# EAGLE schematic Cooler-7805-nano (EAGLE 7.4.0)
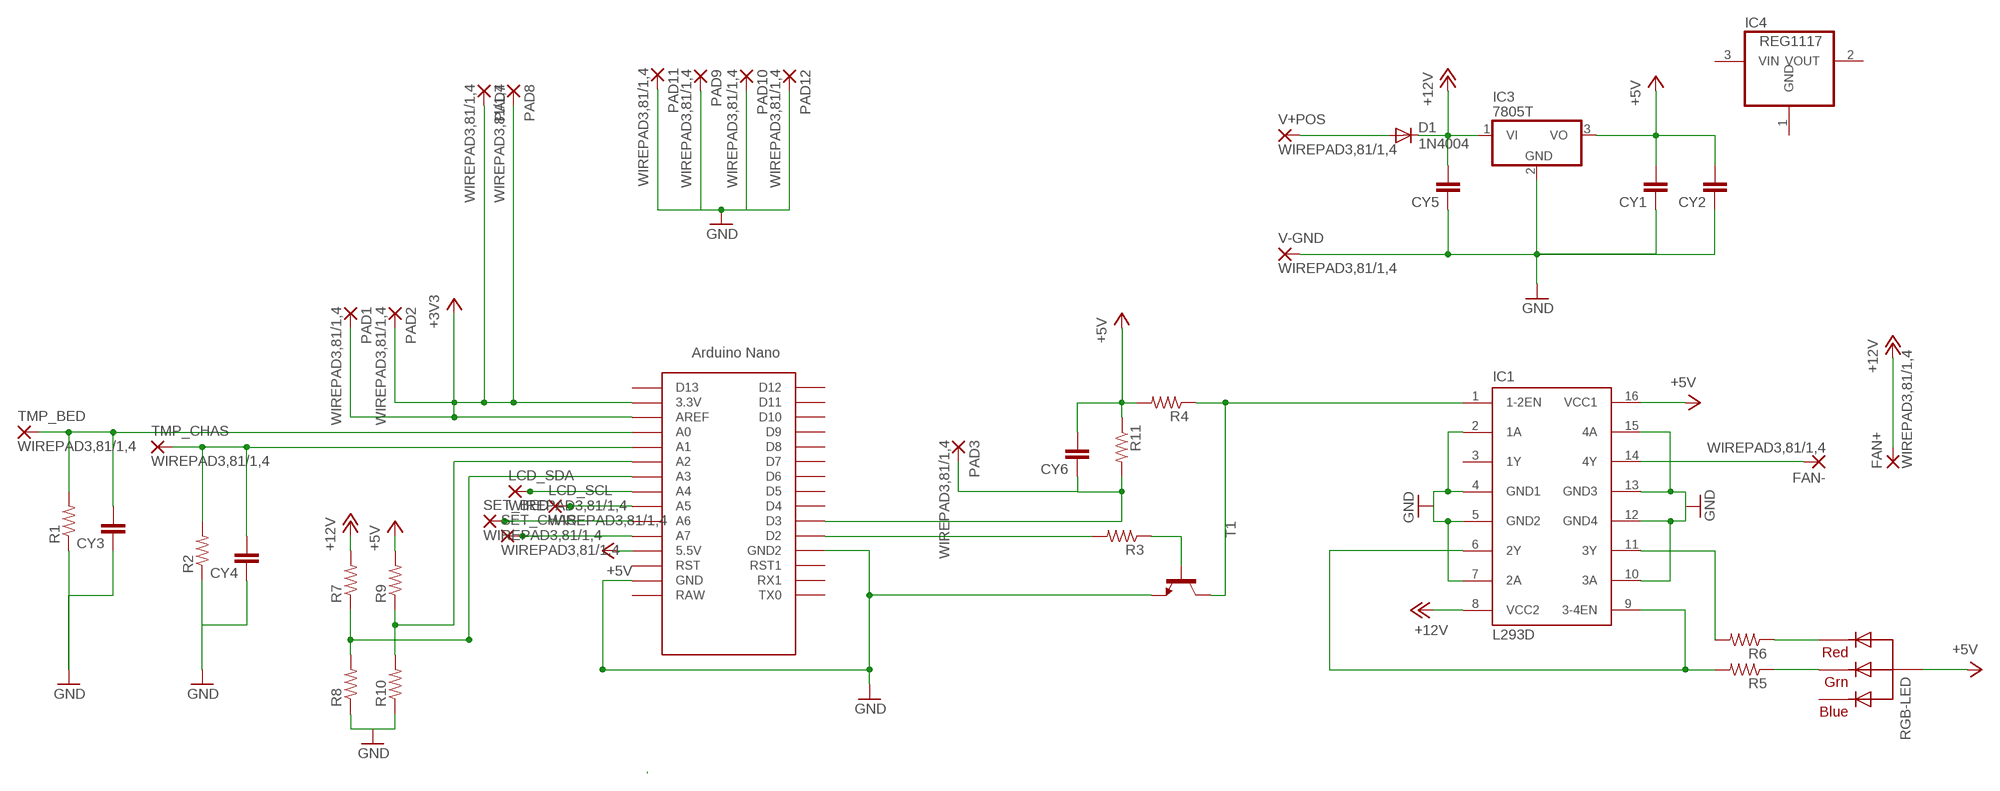
[diagram p0: schematic, sheet 1]

## Parts
CY1  CYYC7B5  [YC7B5]
CY2  CYYC7B5  [YC7B5]
CY3  CYYC7B5  [YC7B5]
CY4  CYYC7B5  [YC7B5]
CY5  CYYC7B5  [YC7B5]
CY6  CYYC7B5  [YC7B5]
D1  1N4004  [DO41-10]
FAN+  WIREPAD3,81/1,4  [3,81/1,4]
FAN-  WIREPAD3,81/1,4  [3,81/1,4]
IC1  L293D  [DIL16]
IC3  7805T  [TO220H]
IC4  REG1117  [SOT223]
LCD_SCL  WIREPAD3,81/1,4  [3,81/1,4]
LCD_SDA  WIREPAD3,81/1,4  [3,81/1,4]
PAD1  WIREPAD3,81/1,4  [3,81/1,4]
PAD2  WIREPAD3,81/1,4  [3,81/1,4]
PAD3  WIREPAD3,81/1,4  [3,81/1,4]
PAD7  WIREPAD3,81/1,4  [3,81/1,4]
PAD8  WIREPAD3,81/1,4  [3,81/1,4]
PAD9  WIREPAD3,81/1,4  [3,81/1,4]
PAD10  WIREPAD3,81/1,4  [3,81/1,4]
PAD11  WIREPAD3,81/1,4  [3,81/1,4]
PAD12  WIREPAD3,81/1,4  [3,81/1,4]
R1  R-US_0309/10  [0309/10]
R2  R-US_0309/10  [0309/10]
R3  R-US_0309/10  [0309/10]
R4  R-US_0309/10  [0309/10]
R5  R-US_0309/12  [0309/12]
R6  R-US_0309/12  [0309/12]
R7  R-US_0309/12  [0309/12]
R8  R-US_0309/10  [0309/10]
R9  R-US_0309/12  [0309/12]
R10  R-US_0309/10  [0309/10]
R11  R-US_0309/10  [0309/10]
RGB-LED  RGBLED_CA-5MM  [LED5MMRGB]
SET_BED  WIREPAD3,81/1,4  [3,81/1,4]
SET_CHAS  WIREPAD3,81/1,4  [3,81/1,4]
T1  2N2222-NPN-TO92-EBC  [TO92-EBC]
TMP_BED  WIREPAD3,81/1,4  [3,81/1,4]
TMP_CHAS  WIREPAD3,81/1,4  [3,81/1,4]
U$2  NANO  [NANO]
V+POS  WIREPAD3,81/1,4  [3,81/1,4]
V-GND  WIREPAD3,81/1,4  [3,81/1,4]

## Nets
+3V3: PAD1.1(P) PAD2.1(P) PAD7.1(P) PAD8.1(P) U$2.3.3V U$2.AREF
+5V: CY1.2 CY2.2 CY6.2 IC1.16(VCC1) IC3.3(VO) R4.2 R9.2 R11.1 RGB-LED.2(VCC) U$2.5V(5.5V)
+12V: CY5.2 D1.C FAN+.1(P) IC1.8(VCC2) IC3.1(VI) R7.2
GND: CY1.1 CY2.1 CY3.1 CY4.1 CY5.1 IC1.2(1A) IC1.4(GND1) IC1.5(GND2) IC1.7(2A) IC1.10(3A) IC1.12(GND4) IC1.13(GND3) IC1.15(4A) IC3.2(GND) PAD9.1(P) PAD10.1(P) PAD11.1(P) PAD12.1(P) R1.1 R2.1 R8.1 R10.1 T1.E U$2.GND U$2.GND1(GND2) V-GND.1(P)
N$3: R3.1 T1.B
N$4: CY3.2 R1.2 TMP_BED.1(P) U$2.A0
N$5: IC1.1(1-2EN) R4.1 T1.C
N$6: CY4.2 R2.2 TMP_CHAS.1(P) U$2.A1
N$7: IC1.6(2Y) IC1.9(3-4EN) R5.2
N$8: IC1.11(3Y) R6.2
N$9: R6.1 RGB-LED.1(RED)
N$10: R5.1 RGB-LED.3(GREEN)
N$11: FAN-.1(P) IC1.14(4Y)
N$13: D1.A V+POS.1(P)
N$14: R3.2 U$2.D2
N$18: SET_BED.1(P) U$2.A6
N$19: CY6.1 PAD3.1(P) R11.2 U$2.D3
N$20: R7.1 R8.2 U$2.A3
N$25: R9.1 R10.2 U$2.A2
N$26: SET_CHAS.1(P) U$2.A7
N$44: LCD_SDA.1(P) U$2.A4
N$45: LCD_SCL.1(P) U$2.A5
Unconnected: IC1.3(1Y) IC4.2(VOUT) IC4.3(VIN) RGB-LED.4(BLUE) U$2.D4 U$2.D5 U$2.D6 U$2.D7 U$2.D8 U$2.D9 U$2.D10 U$2.D11 U$2.D12 U$2.D13 U$2.ICSP1 U$2.ICSP2 U$2.ICSP3 U$2.ICSP4 U$2.ICSP5 U$2.ICSP6 U$2.RAW U$2.RST U$2.RST1 U$2.RX1 U$2.TX0

## Power pins joined to a net without a drawn wire
GND: IC4.1(GND)

## Library data of the parts
CY1-CY6 = resistor:CY: Y CAPACITOR for power line
D1 = adafruit:1N4004: DIODE General purpose 1N400x type rectifier (With bigger pads) http://www.ladyada.net/library/pcb/eaglelibrary.html
FAN+ FAN- LCD_SCL LCD_SDA PAD1-PAD3 PAD7-PAD12 SET_BED SET_CHAS TMP_BED TMP_CHAS V+POS V-GND = wirepad:WIREPAD: Wire PAD connect wire on PCB
IC1 = st-microelectronics:L293D: PUSH-PULL 4 CHANNEL DRIVER; MPN: L293D; OC_FARNELL: 9589619; OC_NEWARK: 56P8249
IC3 = adafruit:78*: Positive VOLTAGE REGULATOR Added bigger pads to the TO-92 package
IC4 = burr-brown:REG1117: 800mA and 1A Low Dropout (LDO) Positive Regulator 1.8V, 2.5V, 2.85V, 3.3V, 5V, and Adj; MPN: REG1117; OC_FARNELL: 1097566; OC_NEWARK: 14P6981
R1-R11 = adafruit:R-US_: RESISTOR, American symbol
RGB-LED = adafruit:RGBLED_CA: RGB LED, common-anode 5MM Staggered pins 5mm Piranha package http://www.ladyada.net/library/pcb/eaglelibrary.html
T1 = transistor-neu-to92:*-NPN-: NPN Transistror
U$2 = Arduino-clone:NANO: Arduino Nano

## Net classes
0 default: width 1.397 mm, drill 0.254 mm, clearance 0.762 mm